# EAGLE design rtc_ds3231_shield (EAGLE 6.0)
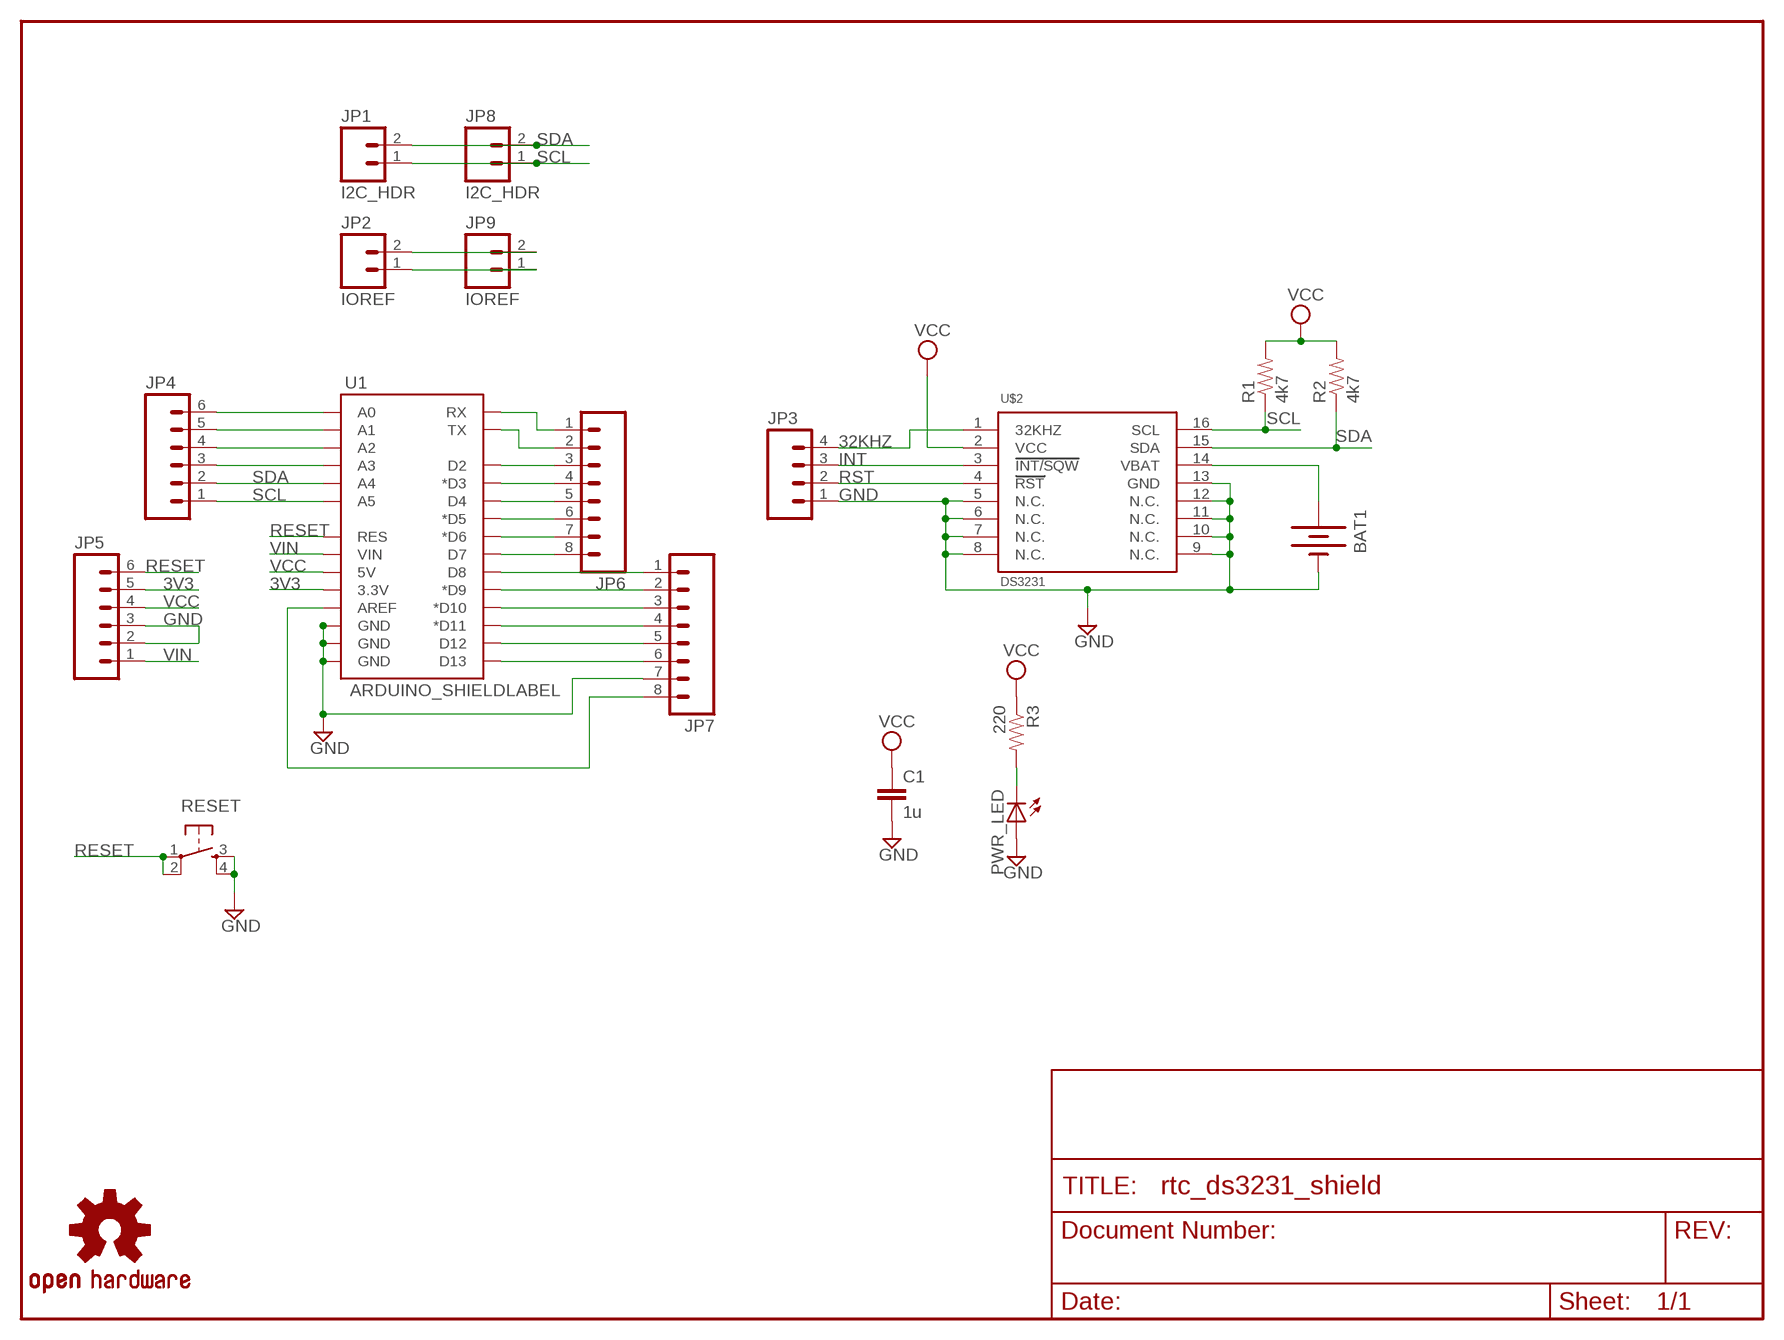
[diagram p0: schematic, sheet 1]

## Parts
BAT1  BATTERY12MM  [BATTCON_12MM]
C1  1u  CAP1206  [1206]
JP1  I2C_HDR  M02PTH  [1X02]
JP2  IOREF  M02PTH  [1X02]
JP3  M04PTH  [1X04]
JP4  M06SIP  [1X06]
JP5  M06SIP  [1X06]
JP6  M081X08  [1X08]
JP7  M081X08  [1X08]
JP8  I2C_HDR  M02PTH  [1X02]
JP9  IOREF  M02PTH  [1X02]
PWR_LED  LED1206  [LED-1206]
R1  4k7  RESISTOR1206  [1206]
R2  4k7  RESISTOR1206  [1206]
R3  220  RESISTOR1206  [1206]
RESET  TAC_SWITCHSMD  [TACTILE_SWITCH_SMD]
U1  ARDUINO_SHIELDLABEL  [UNOR3_SHIELD]
U$2  DS3231  [SO16L]
U$3  OSHW-LOGOM  [OSHW-LOGO-M]

## Nets
3V3: JP5.5 U1.3.3V
32KHZ: JP3.4 U$2.1(32KHZ)
GND: BAT1.GND(-) C1.2 JP3.1 JP5.2 JP5.3 JP7.7 PWR_LED.A RESET.3 RESET.4 U1.GND@0(GND) U1.GND@1(GND) U1.GND@2(GND) U$2.5(N.C.) U$2.6(N.C.) U$2.7(N.C.) U$2.8(N.C.) U$2.9(N.C.) U$2.10(N.C.) U$2.11(N.C.) U$2.12(N.C.) U$2.13(GND)
INT: JP3.3 U$2.3(INT/SQW)
N$1: JP4.6 U1.A0
N$2: JP4.5 U1.A1
N$3: JP4.4 U1.A2
N$4: JP4.3 U1.A3
N$5: PWR_LED.C R3.2
N$7: JP6.2 U1.TX
N$8: JP6.1 U1.RX
N$9: JP6.3 U1.D2
N$10: JP6.4 U1.D3(*D3)
N$11: JP6.5 U1.D4
N$12: JP6.6 U1.D5(*D5)
N$13: JP6.7 U1.D6(*D6)
N$14: JP6.8 U1.D7
N$15: JP7.1 U1.D8
N$16: JP7.2 U1.D9(*D9)
N$17: JP7.3 U1.D10(*D10)
N$18: JP7.4 U1.D11(*D11)
N$19: JP7.5 U1.D12
N$20: JP7.6 U1.D13
N$21: JP2.2 JP9.2
N$22: JP7.8 U1.AREF
N$23: JP2.1 JP9.1
RESET: JP5.6 RESET.1 RESET.2 U1.RES
RST: JP3.2 U$2.4(RST)
SCL: JP1.1 JP4.1 JP8.1 R1.1 U1.A5 U$2.16(SCL)
SDA: JP1.2 JP4.2 JP8.2 R2.1 U1.A4 U$2.15(SDA)
VBAT: BAT1.PWR@2(+) U$2.14(VBAT)
VCC: C1.1 JP5.4 R1.2 R2.2 R3.1 U1.5V U$2.2(VCC)
VIN: JP5.1 U1.VIN

## Library data of the parts
BAT1 = Add-Ohms:BATTERY: Battery Holders Various common sizes : AA, AAA, 20mm coin cell and 12mm coin cell.
C1 = Add-Ohms:CAP: Capacitor Standard 0603 ceramic capacitor, and 0.1" leaded capacitor.
JP1 JP2 JP8 JP9 = SparkFun:M02: Header 2 Standard 2-pin 0.1" header. Use with straight break away headers (SKU : PRT-00116), right angle break away headers (PRT-00553), swiss pins (PRT-00743), machine pins (PRT-00117), and female headers (PRT-00115). Molex polarized connector foot print use with SKU : PRT-08233 with associated crimp pins and housings.
JP3 = SparkFun:M04: Header 4 Standard 4-pin 0.1" header. Use with straight break away headers (SKU : PRT-00116), right angle break away headers (PRT-00553), swiss pins (PRT-00743), machine pins (PRT-00117), and female headers (PRT-00115). Molex polarized connector foot print use with SKU : PRT-08231 with associated crimp pins and housings. 1MM SMD Version SKU: PRT-10208
JP4 JP5 = SparkFun:M06: Header 6 Standard 6-pin 0.1" header. Use with straight break away headers (SKU : PRT-00116), right angle break away headers (PRT-00553), swiss pins (PRT-00743), machine pins (PRT-00117), and female headers (PRT-00115). Molex polarized connector foot print use with SKU : PRT-08094 with associated crimp pins and housings. NOTES ON THE VARIANTS LOCK and LOCK_LONGPADS... This footprint was designed to help hold the alignment of a through-hole component (i.e. 6-pin header) while soldering it into place. You may notice that each hole has been shifted either up or down by 0.005 of an inch from it's more standard position (which is a perfectly straight line). This slight alteration caused the pins (the squares in the middle) to touch the edges of the holes. Because they are alternating, it causes a "brace" to hold the component in place. 0.005 has proven to be the perfect amount of "off-center" position when using our standard breakaway headers. Although looks a little odd when you look at the bare footprint, once you have a header in there, the alteration is very hard to notice. Also, if you push a header all the way into place, it is covered up entirely on the bottom side. This idea of altering the position of holes to aid alignment will be further integrated into the Sparkfun Library for other footprints. It can help hold any component with 3 or more connection pins.
JP6 JP7 = SparkFun:M08: Header 8 Standard 8-pin 0.1" header. Use with straight break away headers (SKU : PRT-00116), right angle break away headers (PRT-00553), swiss pins (PRT-00743), machine pins (PRT-00117), and female headers (PRT-00115).
PWR_LED = Add-Ohms:LED: LEDs Standard schematic elements and footprints for 5mm, 3mm, 1206, and 0603 sized LEDs. 5mm - Spark Fun Electronics SKU : COM-00529 (and others)
R1-R3 = Add-Ohms:RESISTOR: Resistor Basic schematic elements and footprints for 0603, 1206, and PTH resistors.
RESET = Add-Ohms:TAC_SWITCH: Momentary Switch Button commonly used for reset or general input. Spark Fun Electronics SKU : COM-00097
U1 = Add-Ohms:ARDUINO_SHIELD
U$2 = Add-Ohms:DS3231: The DS3231 is a low-cost, extremely accurate I2C real- time clock (RTC) with an integrated temperature- compensated crystal oscillator (TCXO) and crystal. Link to maxim-ic.com: http://www.maxim-ic.com/datasheet/index.mvp/id/4627 The package style is the SOIC-16. This Part was created by James Lewis (james@cmiyc.com). The SMD/PCB footprint was obtained from the Sparkfun Eagle Library. This part (as an indepedant library) can be downloaded from cmiyc.com: <insert link>. Last Update: May 28, 2012.
U$3 = Add-Ohms:OSHW-LOGO: Open Source Hardware Logo This logo indicates the piece of hardware it is found on incorporates a OSHW license and/or adheres to the definition of open source hardware found here: http://freedomdefined.org/OSHW

## Board
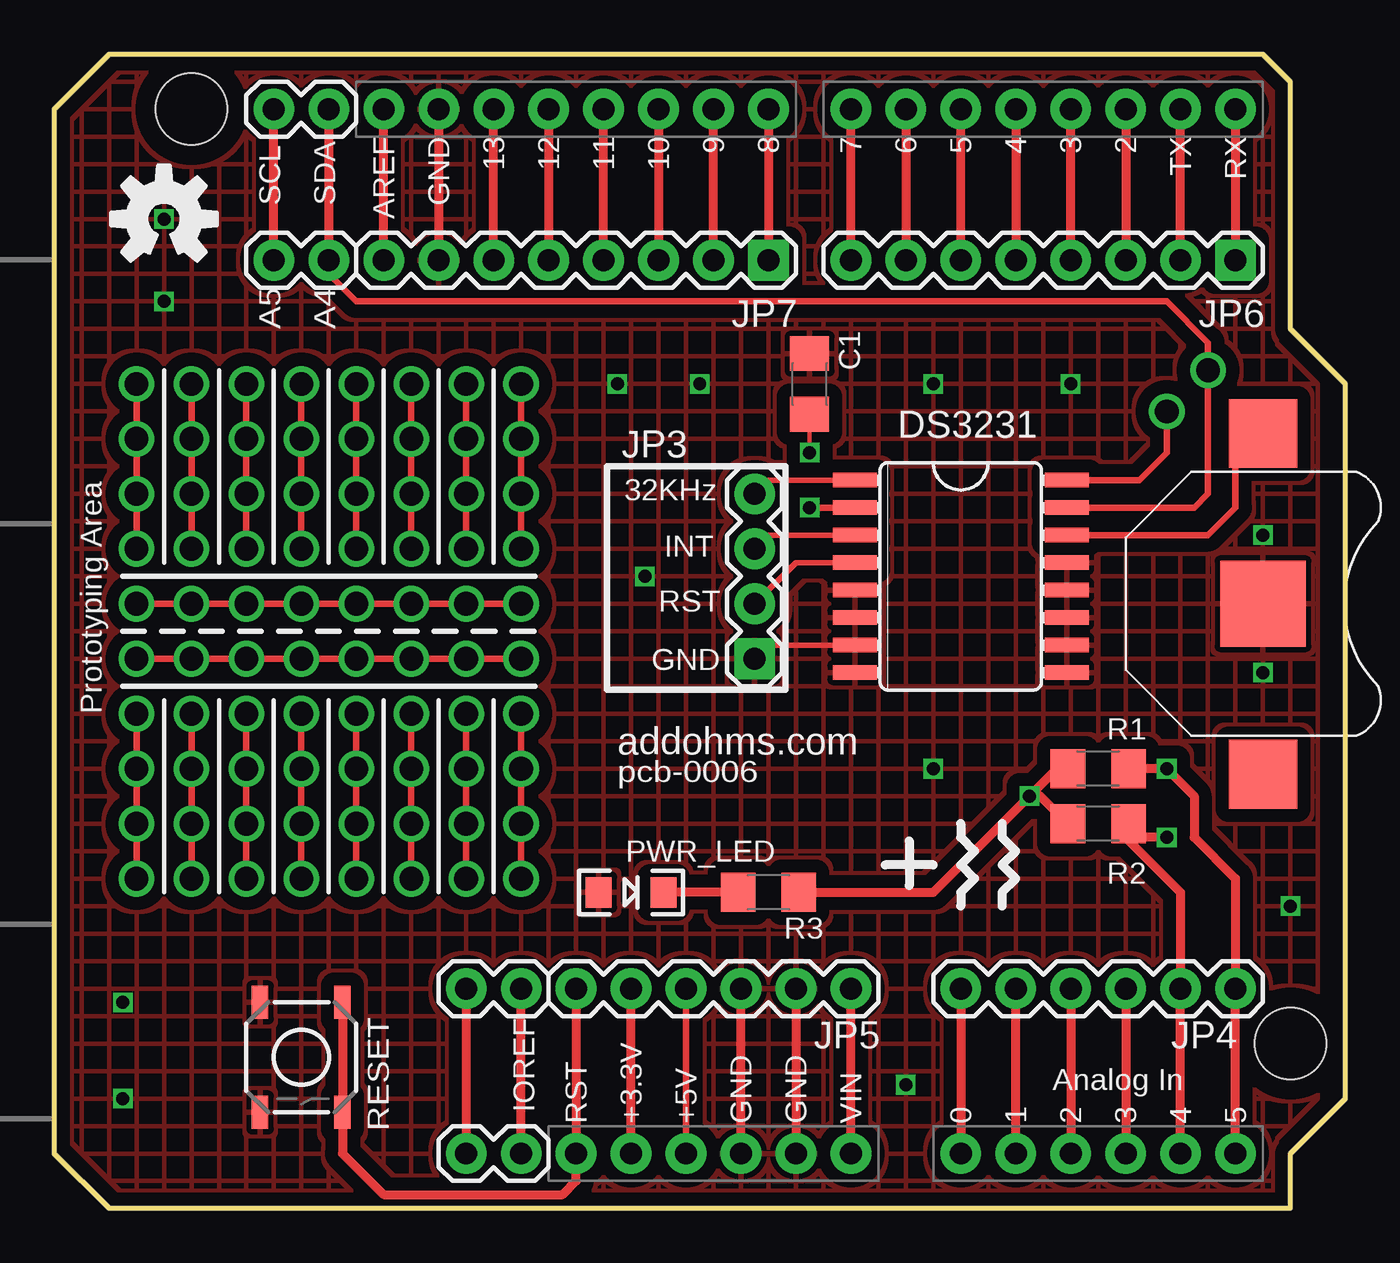
[diagram p1: board, top side]
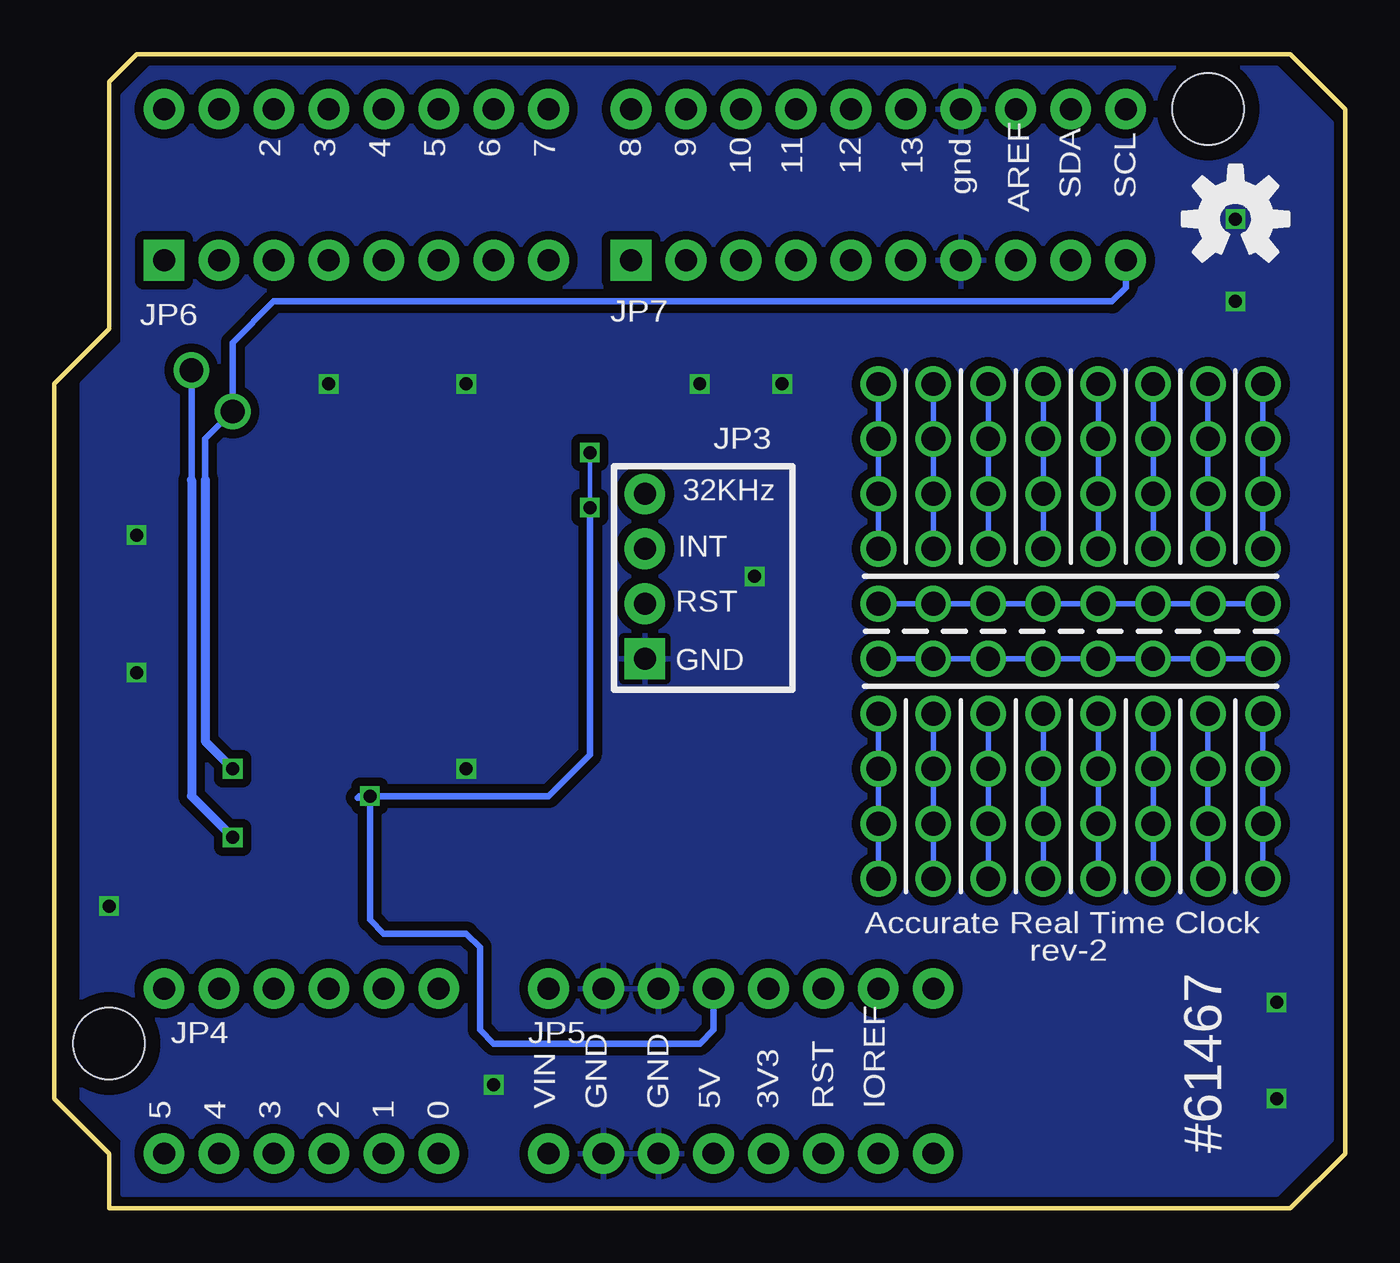
[diagram p2: board, bottom side, seen from below]

Size 59.69 x 53.34 mm. Coordinates in mm from the lower left corner, seen from the top.
Outline: 0,2.54 0,50.8 2.54,53.34 55.88,53.34 57.15,52.07 57.15,40.64 59.69,38.1 59.69,5.08 57.15,2.54 57.15,0 2.54,0 0,2.54
Copper layers (1*16): Top 0.035mm / dielectric 1.5mm / Bottom 0.035mm
Design rules "default": minimum track width 6mil, minimum drill 12mil, track to track 6mil, track to pad 6mil, pad to pad 6mil, via to via 6mil, smd to smd 0mil, copper to edge 10mil, drill to drill 10mil, minimum pad ring 10mil, minimum via ring 6mil, stop-mask expansion 2mil, vias tented up to drill 100mil, thermal gap 10mil

### Footprints (pad centres in the part's own frame; a part is rotated, then mirrored left to right if it is on the bottom)
BATTCON_12MM = smd 3.962 x 3.962: GND 0,0 | smd 3.175 x 3.175: PWR@1 7.874,0; PWR@2 -7.874,0
1206 = smd 1.6 x 1.8: 1 -1.4,0; 2 1.4,0
1X02 = drill 1.016 pad 1.88: 1 0,0; 2 2.54,0
1X04 = drill 1.016 pad 1.88 square: 1 0,0 | drill 1.016 pad 1.88: 2 2.54,0; 3 5.08,0; 4 7.62,0
1X06 = drill 1.016 pad 1.88: 1 0,0; 2 2.54,0; 3 5.08,0; 4 7.62,0; 5 10.16,0; 6 12.7,0
1X08 = drill 1.016 pad 1.88 square: 1 0,0 | drill 1.016 pad 1.88: 2 2.54,0; 3 5.08,0; 4 7.62,0; 5 10.16,0; 6 12.7,0; 7 15.24,0; 8 17.78,0
LED-1206 = smd 1.2 x 1.4: A -1.5,0; C 1.5,0
TACTILE_SWITCH_SMD = smd 1.524 x 0.762: 1 -2.54,1.905; 2 2.54,1.905; 3 -2.54,-1.905; 4 2.54,-1.905
UNOR3_SHIELD = drill 1.016 pad 1.88: 3.3V 50.8,26.67; 5V 50.8,29.21; A0 50.8,41.91; A1 50.8,44.45; A2 50.8,46.99; A3 50.8,49.53; A4 50.8,52.07; A5 50.8,54.61; AREF 2.54,15.24; D2 2.54,49.53; D3 2.54,46.99; D4 2.54,44.45; D5 2.54,41.91; D6 2.54,39.37; D7 2.54,36.83; D8 2.54,33.02; D9 2.54,30.48; D10 2.54,27.94; D11 2.54,25.4; D12 2.54,22.86; D13 2.54,20.32; GND@0 50.8,31.75; GND@1 50.8,34.29; GND@2 2.54,17.78; RES 50.8,24.13; RX 2.54,54.61; TX 2.54,52.07; VIN 50.8,36.83 | hole 3.302: 45.72,57.15; 2.54,6.35
SO16L = smd 0.66 x 2.032: 1 -4.445,-4.902; 2 -3.175,-4.902; 3 -1.905,-4.902; 4 -0.635,-4.902; 5 0.635,-4.902; 6 1.905,-4.902; 7 3.175,-4.902; 8 4.445,-4.902; 9 4.445,4.902; 10 3.175,4.902; 11 1.905,4.902; 12 0.635,4.902; 13 -0.635,4.902; 14 -1.905,4.902; 15 -3.175,4.902; 16 -4.445,4.902

### Placement (x,y rotation side)
BAT1  55.88,27.94 270 top
C1  34.92,38.1 90 top
JP1  10.16,50.8 0 top
JP2  19.05,2.54 0 top
JP3  32.38,25.4 90 top
JP4  54.61,10.16 180 top
JP5  36.83,10.16 180 top
JP6  54.61,43.81 180 top
JP7  33.02,43.81 180 top
JP8  10.16,43.81 0 top
JP9  19.05,10.16 0 top
PWR_LED  26.67,14.61 0 top
R1  48.26,20.32 180 top
R2  48.26,17.78 180 top
R3  33.02,14.61 180 top
RESET  11.43,6.99 270 top
U1  0,53.34 270 top
U$1  OSHW-LOGOM  [OSHW-LOGO-M]  5.08,45.72 0 top
U$2  41.91,29.21 270 top
U$3  5.08,45.72 0 bottom

### Tracks (layer width: path | path; a pad name or v marks a point on that pad's centre or on a via)
3V3
  Top 0.406: U1.3.3V JP5.5
32KHZ
  Top 0.254: U$2.1 33.02,33.66 JP3.4
GND  (via drill 0.6)
  Top 0.254: U$2.7 33.02,26.04 JP3.1
  Top 0.406: U1.GND@0 JP5.3 | JP5.2 U1.GND@1 | U1.GND@2 JP7.7
  other vias: 55.88,31.11 55.88,24.77 39.37,5.71 57.15,13.97 46.99,38.1 40.64,38.1 29.84,38.1 26.04,38.1 27.3,29.21 3.17,5.08 3.17,9.53 5.08,41.91 5.08,45.72 40.64,20.32
  pour Top (isolate 0.61, hatched): 0.64,3.17 0.64,50.16 3.17,52.7 55.24,52.7 56.52,51.44 56.52,40.01 58.42,38.1 58.42,5.71 58.42,5.08 56.52,3.17 56.52,0.64 3.17,0.64
  pour Bottom (isolate 0.406): 0.64,3.17 0.64,50.16 3.17,52.7 55.24,52.7 56.52,51.44 56.52,40.01 58.42,38.1 58.42,5.71 58.42,5.08 56.52,3.17 56.52,0.64 3.17,0.64
INT
  Top 0.254: U$2.3 33.02,31.11 JP3.3
N$1
  Top 0.406: JP4.6 U1.A0
N$2
  Top 0.406: U1.A1 JP4.5
N$3
  Top 0.406: JP4.4 U1.A2
N$4
  Top 0.406: JP4.3 U1.A3
N$5
  Top 0.406: R3.2 PWR_LED.C
N$7
  Top 0.406: JP6.2 U1.TX
N$8
  Top 0.406: U1.RX JP6.1
N$9
  Top 0.406: U1.D2 JP6.3
N$10
  Top 0.406: JP6.4 U1.D3
N$11
  Top 0.406: U1.D4 JP6.5
N$12
  Top 0.406: JP6.6 U1.D5
N$13
  Top 0.406: U1.D6 JP6.7
N$14
  Top 0.406: JP6.8 U1.D7
N$15
  Top 0.406: U1.D8 JP7.1
N$16
  Top 0.406: JP7.2 U1.D9
N$17
  Top 0.406: U1.D10 JP7.3
N$18
  Top 0.406: JP7.4 U1.D11
N$19
  Top 0.406: U1.D12 JP7.5
N$20
  Top 0.406: JP7.6 U1.D13
N$21
  Top 0.406: JP2.2 JP9.2
N$22
  Top 0.406: JP7.8 U1.AREF
N$23
  Top 0.406: JP9.1 JP2.1
N$32  (via drill 1.1 pad 0.25)
  Top 0.305: v3.81,30.48 3.81,38.1
  Bottom 0.254: 3.81,38.1 v3.81,30.48
N$33  (via drill 1.1 pad 0.25)
  other vias: 6.35,33.02
N$34  (via drill 1.1 pad 0.25)
  other vias: 3.81,35.56
N$35  (via drill 1.1 pad 0.25)
  other vias: 3.81,38.1
N$37  (via drill 1.1 pad 0.25)
  Top 0.305: 6.35,38.1 v6.35,30.48
  Bottom 0.254: v6.35,30.48 6.35,38.1
N$38  (via drill 1.1 pad 0.25)
  other vias: 6.35,38.1
N$39  (via drill 1.1 pad 0.25)
  other vias: 6.35,35.56
N$40  (via drill 1.1 pad 0.25)
  other vias: 3.81,33.02
N$42  (via drill 1.1 pad 0.25)
  Top 0.305: v8.89,30.48 8.89,38.1
  Bottom 0.254: 8.89,38.1 v8.89,30.48
N$43  (via drill 1.1 pad 0.25)
  other vias: 8.89,33.02
N$44  (via drill 1.1 pad 0.25)
  other vias: 8.89,35.56
N$45  (via drill 1.1 pad 0.25)
  other vias: 8.89,38.1
N$47  (via drill 1.1 pad 0.25)
  Top 0.305: 11.43,38.1 v11.43,30.48
  Bottom 0.254: v11.43,30.48 11.43,38.1
N$48  (via drill 1.1 pad 0.25)
  other vias: 11.43,38.1
N$49  (via drill 1.1 pad 0.25)
  other vias: 11.43,35.56
N$50  (via drill 1.1 pad 0.25)
  other vias: 11.43,33.02
N$52  (via drill 1.1 pad 0.25)
  Top 0.305: 13.97,38.1 v13.97,30.48
  Bottom 0.254: 13.97,38.1 v13.97,30.48
N$53  (via drill 1.1 pad 0.25)
  other vias: 13.97,38.1
N$54  (via drill 1.1 pad 0.25)
  other vias: 13.97,35.56
N$55  (via drill 1.1 pad 0.25)
  other vias: 13.97,33.02
N$58  (via drill 1.1 pad 0.25)
  other vias: 16.51,33.02
N$59  (via drill 1.1 pad 0.25)
  other vias: 16.51,35.56
N$60  (via drill 1.1 pad 0.25)
  other vias: 16.51,38.1
N$61  (via drill 1.1 pad 0.25)
  Top 0.305: 16.51,38.1 v16.51,30.48
  Bottom 0.254: v16.51,30.48 16.51,38.1
N$62  (via drill 1.1 pad 0.25)
  Top 0.305: 19.05,38.1 v19.05,30.48
  Bottom 0.254: 19.05,38.1 v19.05,30.48
N$63  (via drill 1.1 pad 0.25)
  other vias: 19.05,38.1
N$64  (via drill 1.1 pad 0.25)
  other vias: 19.05,35.56
N$65  (via drill 1.1 pad 0.25)
  other vias: 19.05,33.02
N$68  (via drill 1.1 pad 0.25)
  other vias: 21.59,33.02
N$69  (via drill 1.1 pad 0.25)
  other vias: 21.59,35.56
N$70  (via drill 1.1 pad 0.25)
  other vias: 21.59,38.1
N$71  (via drill 1.1 pad 0.25)
  Top 0.305: 21.59,38.1 v21.59,30.48
  Bottom 0.254: 21.59,38.1 v21.59,30.48
N$78  (via drill 1.1 pad 0.25)
  other vias: 6.35,27.94
N$79  (via drill 1.1 pad 0.25)
  other vias: 6.35,25.4
N$80  (via drill 1.1 pad 0.25)
  other vias: 8.89,25.4
N$81  (via drill 1.1 pad 0.25)
  other vias: 8.89,27.94
N$82  (via drill 1.1 pad 0.25)
  other vias: 11.43,27.94
N$83  (via drill 1.1 pad 0.25)
  other vias: 11.43,25.4
N$84  (via drill 1.1 pad 0.25)
  other vias: 13.97,27.94
N$85  (via drill 1.1 pad 0.25)
  other vias: 13.97,25.4
N$86  (via drill 1.1 pad 0.25)
  other vias: 16.51,25.4
N$87  (via drill 1.1 pad 0.25)
  other vias: 16.51,27.94
N$88  (via drill 1.1 pad 0.25)
  other vias: 19.05,27.94
N$89  (via drill 1.1 pad 0.25)
  other vias: 19.05,25.4
N$90  (via drill 1.1 pad 0.25)
  Top 0.305: v21.59,25.4 v3.81,25.4
  Bottom 0.254: v3.81,25.4 v21.59,25.4
N$91  (via drill 1.1 pad 0.25)
  Top 0.305: v21.59,27.94 v3.81,27.94
  Bottom 0.254: v21.59,27.94 v3.81,27.94
N$103  (via drill 1.1 pad 0.25)
  other vias: 3.81,15.24
N$104  (via drill 1.1 pad 0.25)
  other vias: 3.81,17.78
N$105  (via drill 1.1 pad 0.25)
  other vias: 3.81,20.32
N$106  (via drill 1.1 pad 0.25)
  Top 0.305: v3.81,22.86 3.81,15.24
  Bottom 0.254: v3.81,22.86 3.81,15.24
N$107  (via drill 1.1 pad 0.25)
  Top 0.305: v6.35,22.86 6.35,15.24
  Bottom 0.254: v6.35,22.86 6.35,15.24
N$108  (via drill 1.1 pad 0.25)
  other vias: 6.35,20.32
N$109  (via drill 1.1 pad 0.25)
  other vias: 6.35,17.78
N$110  (via drill 1.1 pad 0.25)
  other vias: 6.35,15.24
N$113  (via drill 1.1 pad 0.25)
  other vias: 8.89,15.24
N$114  (via drill 1.1 pad 0.25)
  other vias: 8.89,17.78
N$115  (via drill 1.1 pad 0.25)
  other vias: 8.89,20.32
N$116  (via drill 1.1 pad 0.25)
  Top 0.305: v8.89,22.86 8.89,15.24
  Bottom 0.254: v8.89,22.86 8.89,15.24
N$117  (via drill 1.1 pad 0.25)
  Top 0.305: v11.43,22.86 11.43,15.24
  Bottom 0.254: v11.43,22.86 11.43,15.24
N$118  (via drill 1.1 pad 0.25)
  other vias: 11.43,20.32
N$119  (via drill 1.1 pad 0.25)
  other vias: 11.43,17.78
N$120  (via drill 1.1 pad 0.25)
  other vias: 11.43,15.24
N$122  (via drill 1.1 pad 0.25)
  Top 0.305: v13.97,22.86 13.97,15.24
  Bottom 0.254: 13.97,15.24 v13.97,22.86
N$123  (via drill 1.1 pad 0.25)
  other vias: 13.97,20.32
N$124  (via drill 1.1 pad 0.25)
  other vias: 13.97,17.78
N$125  (via drill 1.1 pad 0.25)
  other vias: 13.97,15.24
N$128  (via drill 1.1 pad 0.25)
  other vias: 16.51,15.24
N$129  (via drill 1.1 pad 0.25)
  other vias: 16.51,17.78
N$130  (via drill 1.1 pad 0.25)
  other vias: 16.51,20.32
N$131  (via drill 1.1 pad 0.25)
  Top 0.305: v16.51,22.86 16.51,15.24
  Bottom 0.254: v16.51,22.86 16.51,15.24
N$133  (via drill 1.1 pad 0.25)
  other vias: 19.05,20.32
N$134  (via drill 1.1 pad 0.25)
  other vias: 19.05,17.78
N$135  (via drill 1.1 pad 0.25)
  other vias: 19.05,15.24
N$136  (via drill 1.1 pad 0.25)
  Top 0.305: 19.05,15.24 v19.05,22.86
  Bottom 0.254: 19.05,15.24 v19.05,22.86
N$138  (via drill 1.1 pad 0.25)
  other vias: 21.59,15.24
N$139  (via drill 1.1 pad 0.25)
  other vias: 21.59,17.78
N$140  (via drill 1.1 pad 0.25)
  other vias: 21.59,20.32
N$141  (via drill 1.1 pad 0.25)
  Top 0.305: v21.59,22.86 21.59,15.24
  Bottom 0.254: v21.59,22.86 21.59,15.24
RESET
  Top 0.406: JP5.6 U1.RES 24.13,1.27 23.5,0.64 15.24,0.64 13.34,2.54 RESET.2 RESET.1
RST
  Top 0.254: U$2.4 34.29,29.84 JP3.2
SCL  (via drill 0.6, 1.1 pad 0.25)
  Top 0.305: U$2.16 50.16,33.66 51.44,34.92 v51.44,36.83
  Top 0.406: U1.A5 JP4.1 54.61,15.24 52.7,17.14 52.7,19.05 v51.44,20.32 R1.1 | JP8.1 JP1.1
  Bottom 0.305: JP8.1 10.16,42.55 10.79,41.91 49.53,41.91 51.44,40.01 v51.44,36.83 52.7,35.56 52.7,33.66
  Bottom 0.406: 52.7,33.66 52.7,21.59 v51.44,20.32
SDA  (via drill 0.6, 1.1 pad 0.25)
  Top 0.305: JP8.2 12.7,43.18 13.97,41.91 51.44,41.91 53.34,40.01 v53.34,38.73 53.34,33.02 52.7,32.38 U$2.15
  Top 0.406: U1.A4 JP4.2 52.07,14.61 49.66,17.02 R2.1 50.3,17.14 v51.44,17.14 | JP1.2 JP8.2
  Bottom 0.305: v53.34,38.73 53.34,33.66
  Bottom 0.406: 53.34,33.66 53.34,19.05 v51.44,17.14
VBAT
  Top 0.305: U$2.14 53.34,31.11 54.61,32.38 54.61,34.54 BAT1.PWR@2
  Top 0.406: 55.5,36.2 BAT1.PWR@2
VCC  (via drill 0.6)
  Top 0.203: C1.1 v34.92,34.92
  Top 0.305: U$2.2 v34.92,32.38 | JP5.4 U1.5V
  Top 0.406: v45.09,19.05 45.59,19.05 R2.2 | R1.2 46.35,20.32 v45.09,19.05 | R3.1 40.64,14.61 v45.09,19.05
  Bottom 0.203: v34.92,34.92 v34.92,32.38
  Bottom 0.305: v34.92,32.38 34.92,20.95 36.83,19.05 v45.09,19.05 | v45.09,19.05 45.59,19.05 45.66,18.98 45.15,18.98 v45.09,19.05 | JP5.4 29.21,8.26 29.84,7.62 39.37,7.62 40.01,8.26 40.01,12.06 40.64,12.7 44.45,12.7 45.09,13.34 v45.09,19.05
VIN
  Top 0.406: U1.VIN JP5.1

### Text on the board
tPlace: addohms.com
tNames: SCL | SDA | A5 | A4 | 32KHz | INT | RST | GND | Prototyping Area | pcb-0006 | IOREF
bNames: 9 | 8 | 7 | 6 | 5 | 4 | 3 | 2 | 13 | 12 | 11 | 10 | SCL | SDA | gnd | AREF | JP7 | JP6 | JP3 | 32KHz | INT | RST | GND | Accurate Real Time Clock | rev-2 | JP5 | JP4 | IOREF | RST | 3V3 | 5V | GND | GND | VIN | 0 | 1 | 2 | 3 | 4 | 5 | #61467